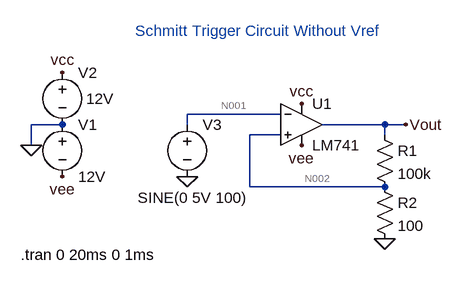
[diagram p0: schematic schmitt_trigger_circuit.asc]
schmitt_trigger_circuit.asc, the LTspice schematic file:
Version 4.1
SHEET 1 880 680
WIRE 304 160 160 160
WIRE -32 176 -80 176
WIRE 160 176 160 160
WIRE 464 176 368 176
WIRE 496 176 464 176
WIRE 304 192 256 192
WIRE 464 192 464 176
WIRE -80 208 -80 176
WIRE 256 272 256 192
WIRE 464 272 256 272
FLAG -80 208 0
FLAG -32 96 vcc
FLAG -32 256 vee
FLAG 336 144 vcc
FLAG 336 208 vee
FLAG 160 256 0
FLAG 496 176 Vout
FLAG 464 352 0
SYMBOL voltage -32 160 R0
WINDOW 123 0 0 Left 0
WINDOW 39 0 0 Left 0
SYMATTR InstName V1
SYMATTR Value 12V
SYMBOL voltage -32 80 R0
WINDOW 3 37 56 Left 2
WINDOW 123 0 0 Left 0
WINDOW 39 0 0 Left 0
SYMATTR Value 12V
SYMATTR InstName V2
SYMBOL LM741 336 112 R0
SYMATTR InstName U1
SYMBOL voltage 160 160 R0
WINDOW 3 -76 129 Left 2
WINDOW 123 0 0 Left 0
WINDOW 39 0 0 Left 0
SYMATTR Value SINE(0 5V 100)
SYMATTR InstName V3
SYMBOL res 448 176 R0
SYMATTR InstName R1
SYMATTR Value 100k
SYMBOL res 448 256 R0
SYMATTR InstName R2
SYMATTR Value 100
TEXT 80 32 Left 2 ;Schmitt Trigger Circuit Without Vref
TEXT -96 376 Left 2 !.tran 0 20ms 0 1ms

The netlist it stands for:
* schmitt_trigger_circuit.asc
V1 0 vee 12V
V2 vcc 0 12V
X§U1 N002 N001 vcc vee Vout LM741  ; pins In+ In- V+ V- OUT
V3 N001 0 SINE(0 5V 100)
R1 Vout N002 100k
R2 N002 0 100
* Schmitt Trigger Circuit Without Vref
.tran 0 20ms 0 1ms
.lib LM741.lib
.backanno
.end

* Results of the author's LTspice run, read from the files saved beside the schematic
* Operating Point, zero values left out:
*   V(vcc) = 12 V
*   V(vout) = -1 V
*   V(vee) = -12 V
*   V(n002) = -1.005 mV
*   I(V1) = -1.631 mA
*   I(R1) = -9.992 µA
*   I(R2) = -10.05 µA
*   I(V2) = -1.621 mA
*   I(V3) = -101.9 nA
*   Ix(u1:1) = 57.84 nA
*   Ix(u1:2) = 101.9 nA
*   Ix(u1:99) = 1.621 mA
*   Ix(u1:50) = -1.631 mA
*   Ix(u1:28) = 9.992 µA
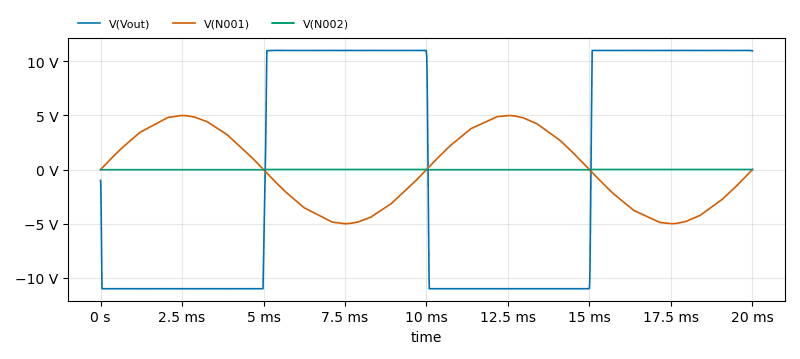
[diagram p1: Transient Analysis of schmitt_trigger_circuit.asc, plotted from the saved traces]
* Transient Analysis, 1 run:
*   V(Vout): min -11.02 V, max 11.02 V, average -40.43 mV, rms 10.96 V, last 10.98 V
*   V(N001): min -5 V, max 5 V, average 38.85 µV, rms 3.528 V, last 0 V
*   V(N002): min -10.98 mV, max 10.97 mV, average -46.34 µV, rms 10.31 mV, last 10.96 mV